# Altium schematic sheet Comm.SchDoc
size A3; SheetNumber: 5; SheetTotal: 6
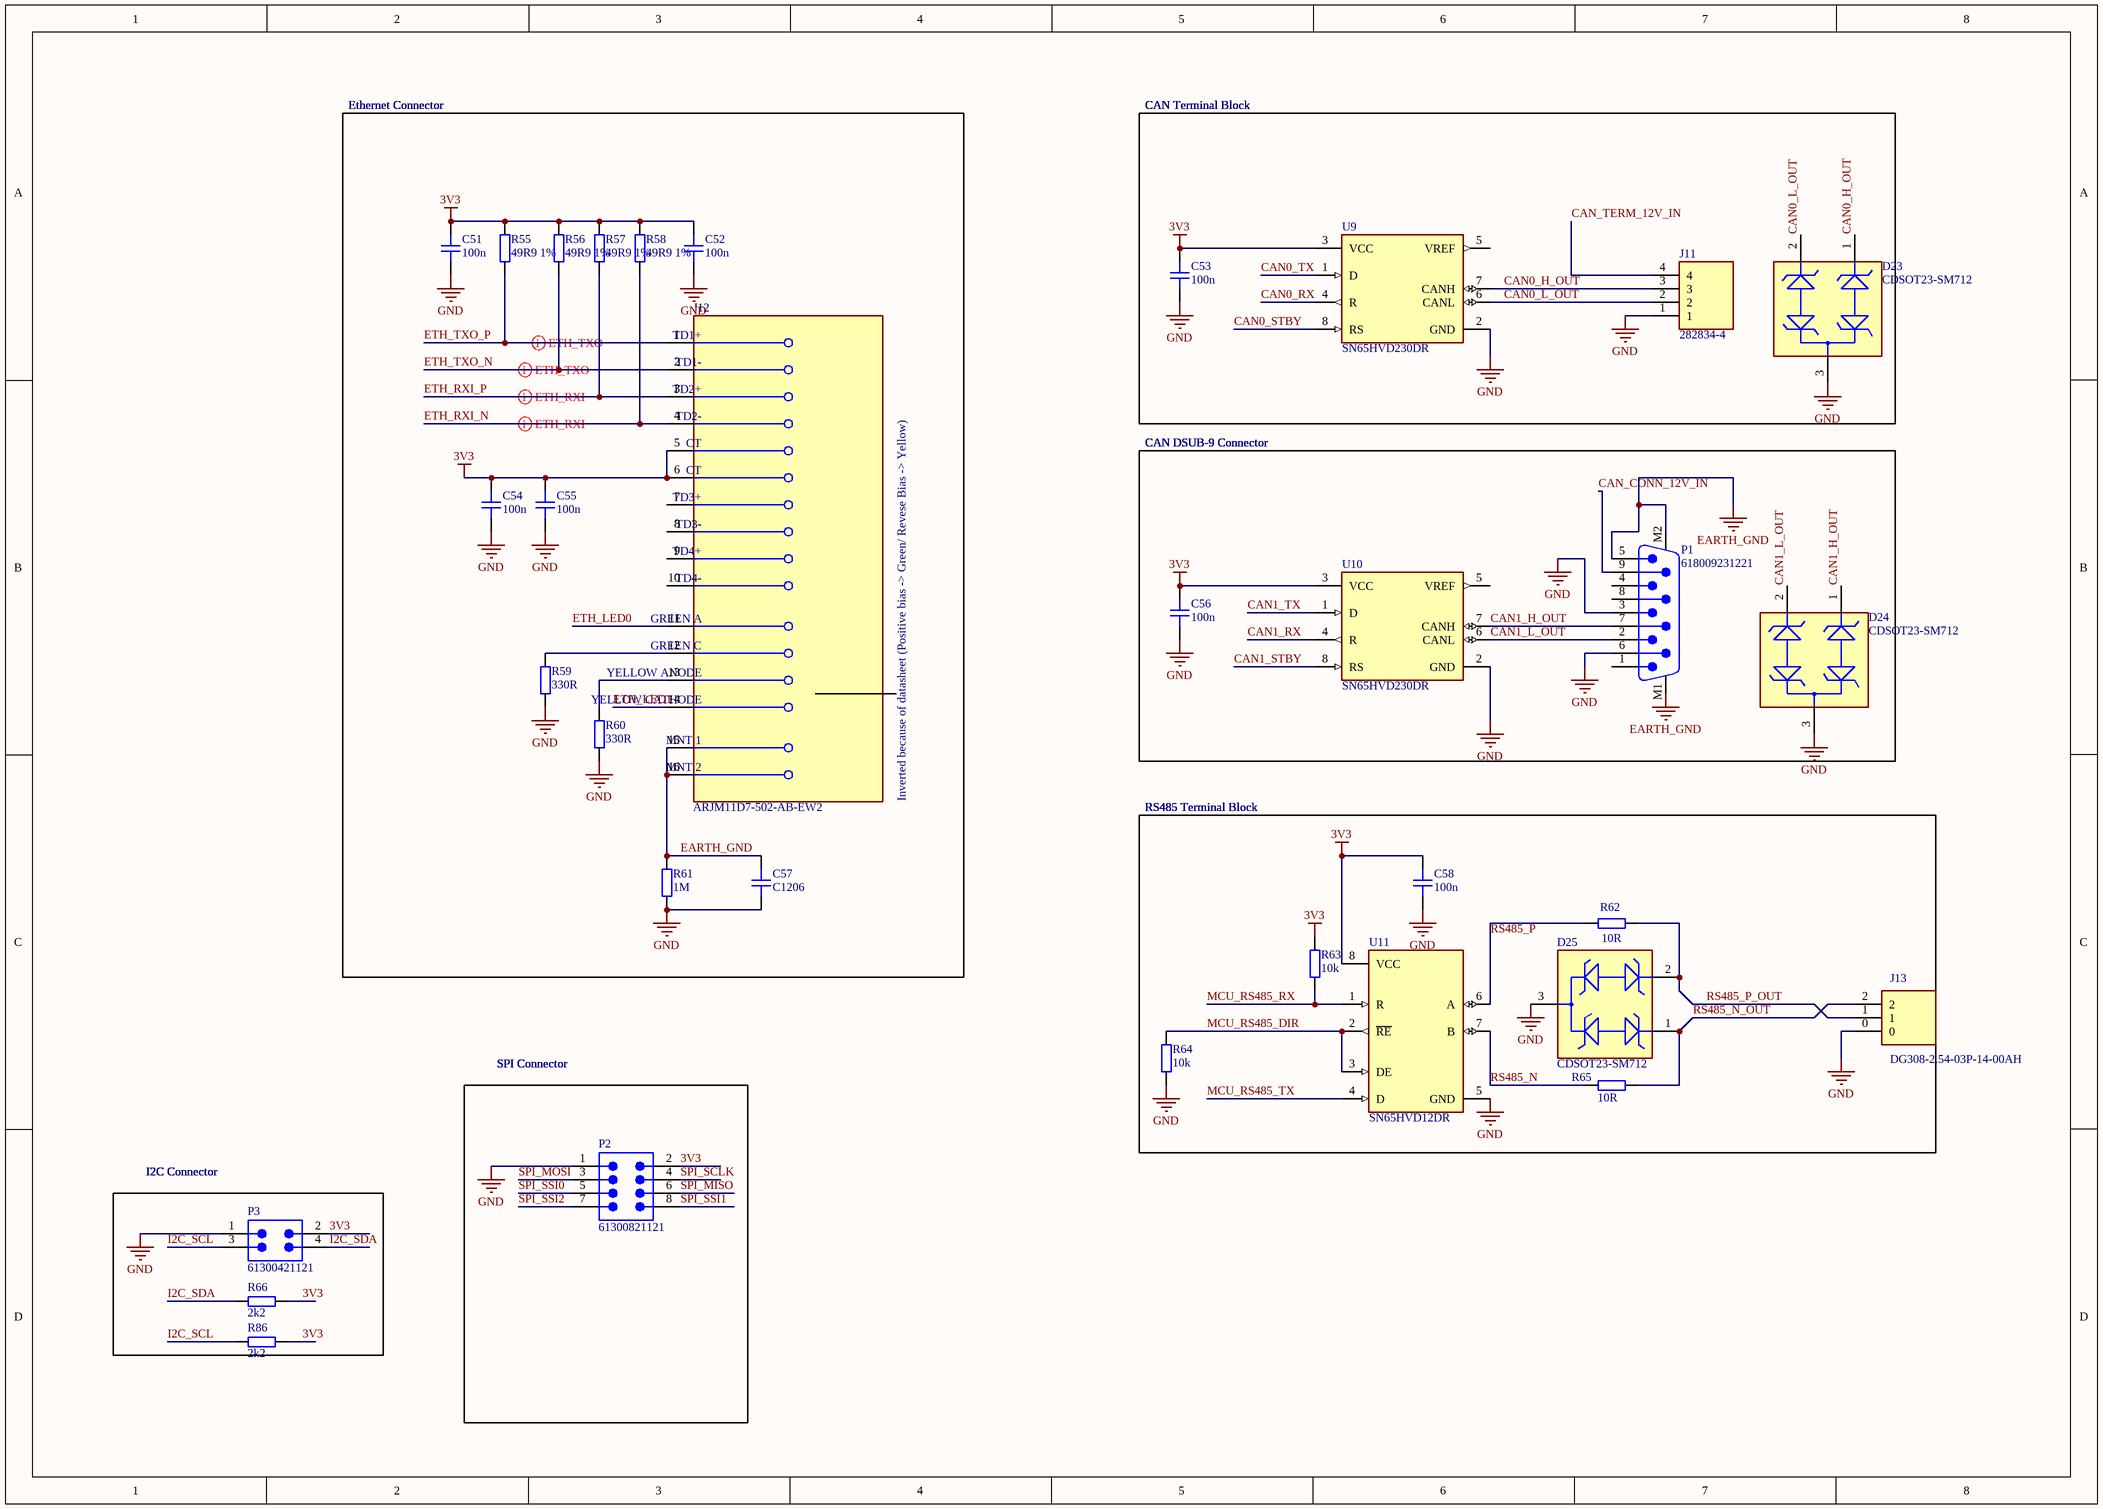
[diagram p0: Comm.SchDoc]

## Parts
C51  100n  [CAP_0402]
C52  100n  [CAP_0402]
C53  100n  [CAP_0402]
C54  100n  [CAP_0402]
C55  100n  [CAP_0402]
C56  100n  [CAP_0402]
C57  C1206  [CAP_1206]
C58  100n  [CAP_0402]
D23  CDSOT23-SM712  [FP-SOT23-MFG]
D24  CDSOT23-SM712  [FP-SOT23-MFG]
D25  CDSOT23-SM712  [FP-SOT23-MFG]
J11  282834-4  [TE_282834-4]
J12  ARJM11D7-502-AB-EW2  [FP-ARJM11D7-502-AB-EW2-MFG]
J13  DG308-2.54-03P-14-00AH  [DG308-2.54-03P-14-00AH-Footprint-1]
P1  618009231221  [618009231221]
P2  61300821121  [61300821121]
P3  61300421121  [61300421121]
R55  49R9 1%  [RES_0402]
R56  49R9 1%  [RES_0402]
R57  49R9 1%  [RES_0402]
R58  49R9 1%  [RES_0402]
R59  330R  [RES_0402]
R60  330R  [RES_0402]
R61  1M  [RES_0402]
R62  10R  [RES_0603]
R63  10k  [RES_0402]
R64  10k  [RES_0402]
R65  10R  [RES_0603]
R66  2k2  [RES_0402]
R86  2k2  [RES_0402]
U9  SN65HVD230DR  [FP-D0008A-IPC_A]
U10  SN65HVD230DR  [FP-D0008A-IPC_A]
U11  SN65HVD12DR  [FP-D0008A-MFG]

## Nets
3V3: C51.2 C52.2 C53.2 C54.2 C55.2 C56.2 C58.2 J12.5(CT) J12.6(CT) P2.2 P3.2 R55.2 R56.2 R57.2 R58.2 R63.2 R66.1 R86.1 U9.3(VCC) U10.3(VCC) U11.8(VCC)
EARTH_GND: C57.2 J12.15(MNT_1) J12.16(MNT_2) P1.5 P1.M1 P1.M2 R61.2
GND: C51.1 C52.1 C53.1 C54.1 C55.1 C56.1 C57.1 C58.1 D23.3 D24.3 D25.3 J11.1 J13.0 P1.3 P1.6 P2.1 P3.1 R59.1 R60.1 R61.1 R64.1 U9.2(GND) U10.2(GND) U11.5(GND)
CAN0_H_OUT: D23.1 J11.3 U9.7(CANH)
CAN0_L_OUT: D23.2 J11.2 U9.6(CANL)
CAN0_RX: U9.4(R)
CAN0_STBY: U9.8(RS)
CAN0_TX: U9.1(D)
CAN1_H_OUT: D24.1 P1.7 U10.7(CANH)
CAN1_L_OUT: D24.2 P1.2 U10.6(CANL)
CAN1_RX: U10.4(R)
CAN1_STBY: U10.8(RS)
CAN1_TX: U10.1(D)
CAN_CONN_12V_IN: P1.9
CAN_TERM_12V_IN: J11.4
ETH_LED0: J12.11(GREEN_A)
ETH_LED1: J12.14(YELLOW_CATHODE)
ETH_RXI_N: J12.4(TD2-) R58.1
ETH_RXI_P: J12.3(TD2+) R57.1
ETH_TXO_N: J12.2(TD1-) R56.1
ETH_TXO_P: J12.1(TD1+) R55.1
I2C_SCL: P3.3 R86.2
I2C_SDA: P3.4 R66.2
MCU_RS485_DIR: R64.2 U11.2(~{RE}) U11.3(DE)
MCU_RS485_RX: R63.1 U11.1(R)
MCU_RS485_TX: U11.4(D)
RS485_N: R65.1 U11.7(B)
RS485_N_OUT: D25.1 J13.2 R65.2
RS485_P: R62.1 U11.6(A)
RS485_P_OUT: D25.2 J13.1 R62.2
SPI_MISO: P2.6
SPI_MOSI: P2.3
SPI_SCLK: P2.4
SPI_SSI0: P2.5
SPI_SSI1: P2.8
SPI_SSI2: P2.7
NetJ12_12: J12.12(GREEN_C) R59.2
NetJ12_13: J12.13(YELLOW_ANODE) R60.2

Not connected (* = marked no-connect by the designer): J12 7(TD3+) 8(TD3-) 9(TD4+) 10(TD4-); P1 1 4 8; U9 5(VREF); U10 5(VREF)

## Layout directives
differential pair; differential pair class ETH: ETH_RXI_N, ETH_RXI_P, ETH_TXO_N, ETH_TXO_P

## Notes on the sheet
- Ethernet Connector
- CAN Terminal Block
- CAN DSUB-9 Connector
- Inverted because of datasheet (Positive bias -> Green/ Revese Bias -> Yellow)
- RS485 Terminal Block
- SPI Connector
- I2C Connector

## Library data of the parts
C51-C56 C58 = CAP_0402: Capacitor SMD 0402; Manufacturer: *; Manufacturer Part Number: *; Distributor Link: *; LCSC: *; Rating: *; Dielectric: *
C57 = CAP_1206: 4700pF 2kV; Manufacturer: *; Manufacturer Part Number: *; Distributor Link: *; LCSC: *; Rating: *; Dielectric: *
D23-D25 = CMP-2000-05081-2: TVS DIODE 7V/12V 14V/26V SOT23-3; Manufacturer: Bourns Inc.; Peak Pulse Current: 17A; Standoff Height: 0.05mm; Breakdown Voltage: 7.5V; Direction: Bidirectional; Clamping Voltage: 26V; Value: 75pF; Number Of Channels: 2; Reverse Standoff Voltage: 12V; Peak Pulse Power: 400W; Temperature Range Low: -55°C; Mouser Description: Transient Voltage Suppressor, TVS, CDSOT23 Series, Unidirectional, 12 V, SOT-23, 3, 13.3 V; Device Class L3: unset; Package: SOT23; Height: 1.17mm; RoHS: TRUE; Octopart: https://octopart.com/cdsot23-sm712-bourns-7576327; Category: Diode; Ipc Land Pattern Name: SOT95P229X103-3; ComponentLink2URL: https://www.bourns.com/docs/Product-Datasheets/CDSOT23-SM712.pdf; Temperature Range High: +150°C; ComponentLink2Description: Datasheet; Digikey Description: TVS DIODE 7V/12V 14V/26V SOT23-3; Manufacturer Part Number: CDSOT23-SM712; Temperature: -55°C to +150°C; Device Class L2: TVS Diodes; Lead Free: Yes; Device Class L1: Circuit Protection; Automotive: No; Capacitance: 75pF
J11 = 282834-4: 4 Position Wire to Board Terminal Block Horizontal with Board 0.100 (2.54mm) Through Hole; MF: TE Connectivity; Check_prices: https://www.snapeda.com/parts/282834-4/TE+Connectivity+AMP+Connectors/view-part/?ref=eda; Price: None; MP: 282834-4; Package: None; Value: *; Purchase-URL: https://pricing.snapeda.com/search/part/282834-4/?ref=eda; Availability: In Stock; EU_RoHS_Compliance: Compliant with Exemptions; SnapEDA_Link: https://www.snapeda.com/parts/282834-4/TE+Connectivity+AMP+Connectors/view-part/?ref=snap
J12 = CMP-27893-000003-1: CONN JACK 1PORT 1000 BASE-T PCB; Number of Ports: 1; Connector Type: RJ45; Shielding: Shielded; Direction: Up; Number of Cores per Jack: 8; Max Operating Temperature: 85°C; Min Operating Temperature: -40°C; Contact Plating: Gold; RoHS Compliant: Yes; Termination: Solder; Mount: Through Hole; Color: Green; Number of Rows: 1; Packaging: Tray
J13 = CMP-002-00073-4: 2.54mm PCB Terminal Block Angled 90 Degree
P1 = CMP-1502-00284-2: NexarPartId: 22865742; Pitch: 2.77mm; Number of Contacts: 9; Operating Supply Voltage: 125V; Insulation Resistance: 5GΩ; Gender: Male; Contact Resistance: 30mΩ; Current Rating: 3A; Mount: Through Hole; Housing Material: Steel; Contact Plating: Gold; Width: 12.5mm; Insulation Material: PBT; RoHS: Compliant; Depth: 18.5mm; Contact Material: Gold; Max Operating Temperature: 105°C; Min Operating Temperature: -55°C; Termination: SMD/SMT; Height: 12.7mm; Voltage Rating: 125V; Length: 30.8mm; Orientation: Right Angle; Number of Rows: 2; Number of Pins: 9; REACH SVHC: Unknown
P2 = CMP-1502-01078-2: NexarPartId: 32855534; Operating Supply Voltage: 250V; Row Spacing: 2.54mm; Contact Resistance: 20mΩ; Number of Contacts: 8; Current Rating: 3A; Connector Type: Male Pin; Gender: Male; Min Operating Temperature: -40°C; Number of Pins: 8; Mount: Through Hole; Height: 8.89mm; Lead Pitch: 2.54mm; Contact Mating Length: 5.9944mm; Packaging: Bulk; Pitch: 2.54mm; RoHS: Compliant; Number of Rows: 2; REACH SVHC: Unknown; Termination: Solder; Orientation: Vertical; Contact Plating: Gold; Max Operating Temperature: 105°C; Number of Positions: 8; Lead Free: Lead Free; Contact Material: Copper; Color: Black; Voltage Rating: 250V
P3 = CMP-1502-01066-3: NexarPartId: 32855524; Number of Positions: 4; Connector Type: Male Pin; Row Spacing: 2.54mm; Current Rating: 3A; Gender: Male; Voltage Rating: 250V; Contact Resistance: 20mΩ; Contact Mating Length: 5.9944mm; Height: 8.89mm; Contact Plating: Gold; Color: Black; Lead Pitch: 2.54mm; Contact Material: Copper; Number of Rows: 2; Min Operating Temperature: -40°C; Mount: Through Hole; RoHS: Compliant; Number of Pins: 4; Lead Free: Lead Free; Packaging: Bulk; Max Operating Temperature: 105°C; Orientation: Vertical; Pitch: 2.54mm; Number of Contacts: 4; Operating Supply Voltage: 250V; REACH SVHC: Unknown; Termination: Solder
R55-R61 R63 R64 R66 R86 = RES_0402: Resistor SMD 0402; Manufacturer: *; Manufacturer Part Number: *; Distributor Link: *; LCSC: *
R62 R65 = RES_0603: Resistor SMD 0603; Manufacturer: *; Manufacturer Part Number: *; Distributor Link: *; LCSC: *
U9 U10 = CMP-0315-00015-3: IC TRANSCEIVER HALF 1/1 8SOIC; Number of Transceivers: 1; Operating Supply Voltage: 3.3V; Number of I/Os: 2; Max Supply Current: 17mA; Max Supply Voltage: 3.6V; Min Supply Voltage: 3V; Data Rate: 1Mbps; Min Operating Temperature: -40°C; Packaging: Tape and Reel; Lead Free: Lead Free; Number of Transmit Buffers: 1; Max Operating Temperature: 85°C; Number of Receive Buffers: 1; Number of Pins: 8; Package Quantity: 1; Radiation Hardening: No; Case/Package: D; REACH SVHC: No SVHC; Weight: 0.002561oz; Termination: SMD/SMT; Contact Plating: Gold; Nominal Supply Current: 17mA; Number of Receivers: 1; Number of Drivers: 1
U11 = CMP-04875-000007-1: IC TRANSCEIVER HALF 1/1 8SOIC; Manufacturer: Texas Instruments; Standoff Height: 0.11mm; Max Supply Voltage: 3.6V; Simplex Duplex: Half Duplex; Min Supply Voltage: 3V; Number Of Receivers: 1; Interface: RS-485,RS-422; Max Junction Temp: +145°C; Nominal Supply Current: 9mA; Data Rate: 1Mbits/s; Manufacturer Part Number: SN65HVD12DR; Digikey Description: IC TRANSCEIVER HALF 1/1 8SOIC; Category: IC; Octopart: https://octopart.com/sn65hvd12dr-texas+instruments-713591; RoHS: TRUE; Temperature Range Low: -40°C; Device Class L2: Interface ICs; Device Class L3: RS-232 / RS-422 / RS-485 Interface ICs; Lead Free: Yes; Mouser Description: RS-485 Interface IC 3.3V Differential Transceivers; Ambient Temperature Range Low: -40°C; Number Of Transmitters: 1; Ipc Land Pattern Name: SOIC127P600X175-8; Temperature Range High: +85°C; ComponentLink2URL: http://www.ti.com/lit/ds/symlink/sn65hvd12.pdf; Package: D0008A; ComponentLink2Description: Datasheet; Height: 1.75mm; Automotive: No; Device Class L1: Integrated Circuits (ICs); Temperature: -40°C to +85°C; Ambient Temperature Range High: +85°C